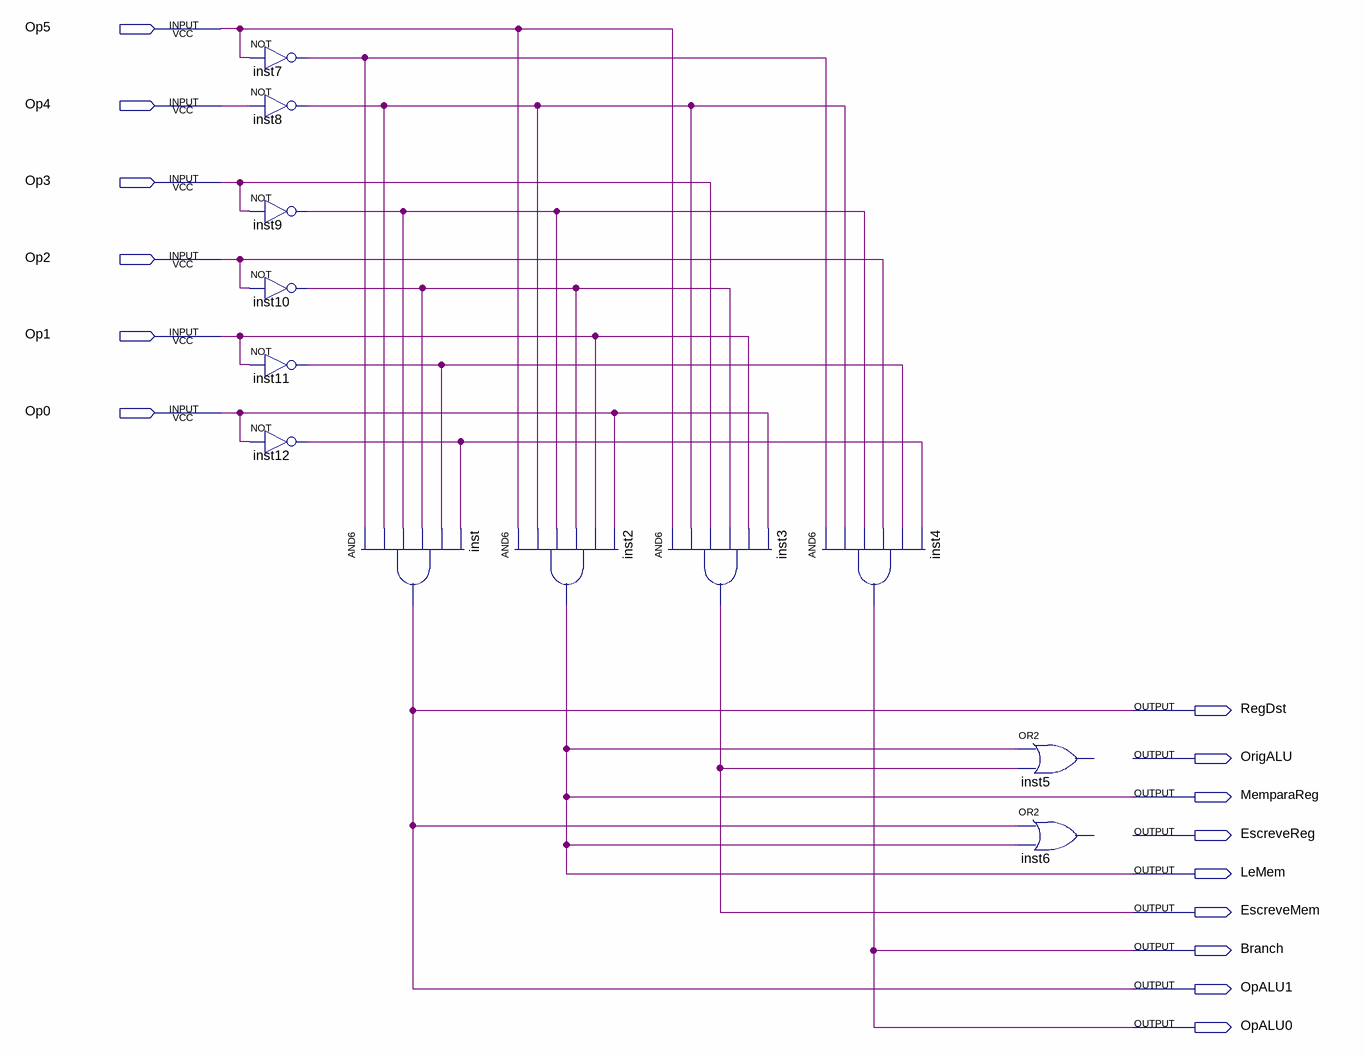
[diagram p0: schematic sheet]
// Quartus schematic Controle.bdf as structural Verilog: 12 symbols, 15 pins
module Controle (
  input  Op5,
  input  Op4,
  input  Op3,
  input  Op2,
  input  Op1,
  input  Op0,
  output RegDst,
  output OrigALU,
  output MemparaReg,
  output EscreveReg,
  output LeMem,
  output EscreveMem,
  output Branch,
  output OpALU1,
  output OpALU0
);

  wire inst7_out, inst8_out, inst9_out, inst10_out, inst11_out, inst12_out;

  not inst7 (inst7_out, Op5);
  not inst8 (inst8_out, Op4);
  not inst9 (inst9_out, Op3);
  not inst10 (inst10_out, Op2);
  not inst11 (inst11_out, Op1);
  not inst12 (inst12_out, Op0);
  and inst (OpALU1, inst7_out, inst8_out, inst9_out, inst10_out, inst11_out, inst12_out);
  and inst2 (LeMem, Op5, inst8_out, inst9_out, inst10_out, Op1, Op0);
  and inst3 (EscreveMem, Op5, inst8_out, Op3, inst10_out, Op1, Op0);
  and inst4 (Branch, inst7_out, inst8_out, inst9_out, Op2, inst11_out, inst12_out);
  // OR2 inst5 has open pins: IN1=LeMem, IN2=EscreveMem, OUT=open
  // OR2 inst6 has open pins: IN1=OpALU1, IN2=LeMem, OUT=open

  assign MemparaReg = LeMem;
  assign OpALU0 = Branch;
  assign RegDst = OpALU1;
endmodule
